# Altium schematic sheet W5500.SchDoc
size A4
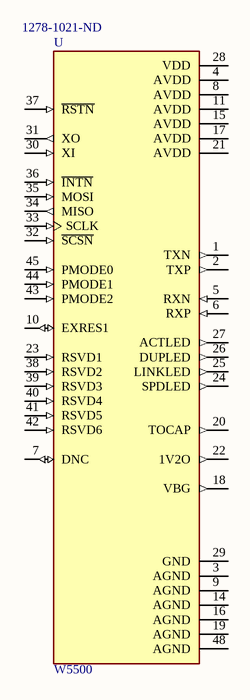
[diagram p0: W5500.SchDoc]

## Parts
U  W5500  Supplier Part Number 1: 1278-1021-ND  [QFP50P900X900X160-48N]

## Nets

Not connected (* = marked no-connect by the designer): U 1(TXN) 2(TXP) 3(AGND) 4(AVDD) 5(RXN) 6(RXP) 7(DNC) 8(AVDD) 9(AGND) 10(EXRES1) 11(AVDD) 14(AGND) 15(AVDD) 16(AGND) 17(AVDD) 18(VBG) 19(AGND) 20(TOCAP) 21(AVDD) 22(1V2O) 23(RSVD1) 24(SPDLED) 25(LINKLED) 26(DUPLED) 27(ACTLED) 28(VDD) 29(GND) 30(XI) 31(XO) 32(~{SCSN}) 33(SCLK) 34(MISO) 35(MOSI) 36(~{INTN}) 37(~{RSTN}) 38(RSVD2) 39(RSVD3) 40(RSVD4) 41(RSVD5) 42(RSVD6) 43(PMODE2) 44(PMODE1) 45(PMODE0) 48(AGND)

## Library data of the parts
U = W5500: Ethernet CTLR Single Chip 10Mbps/100Mbps 3.3V 48-Pin LQFP Reel; MF: WIZnet; Max Supply Current: 132mA; Number of Transceivers: 1; Max Supply Voltage: 3.63V; Min Supply Voltage: 2.97V; Interface: SPI; Price: None; Package: LQFP-48 WIZnet; Value: *; MP: W5500; Availability: Unavailable; SnapEDA_Link: https://www.snapeda.com/parts/W5500/WIZnet/view-part/45250/?ref=snap; Supplier 1: Digi-Key; Manufacturer: WIZnet; Manufacturer Part Number: W5500; RoHS: Yes; Category: Integrated Circuits (ICs); Stock 1: 5025; Pricing 1: 1=3.95000, 10=3.54600, 25=3.35240, 100=2.75650, 250=2.47340, 500=2.38400, 1000=1.98170, 2500=1.90720, 5000=1.84760 (USD); Case/Package: LQFP; Number of Pins: 48; Min Operating Temperature: -40°C; Max Operating Temperature: 85°C; Packaging: Tray; Package Quantity: 250; Operating Supply Current: 132mA; Lead Free: Lead Free; ComponentLink1URL: https://datasheet.ciiva.com/29644/w5500-ds-v100e-29644866.pdf?src-supplier=Digi-Key; ComponentLink1Description: https://datasheet.ciiva.com/29644/w5500-ds-v100e-29644866.pdf?src-supplier=Digi-Key; ComponentLink2URL: https://datasheet.ciiva.com/24199/w5500-24199988.pdf?src-supplier=Future+Electronics; ComponentLink2Description: https://datasheet.ciiva.com/24199/w5500-24199988.pdf?src-supplier=Future+Electronics